# EAGLE design weblight (EAGLE 7.4.0)
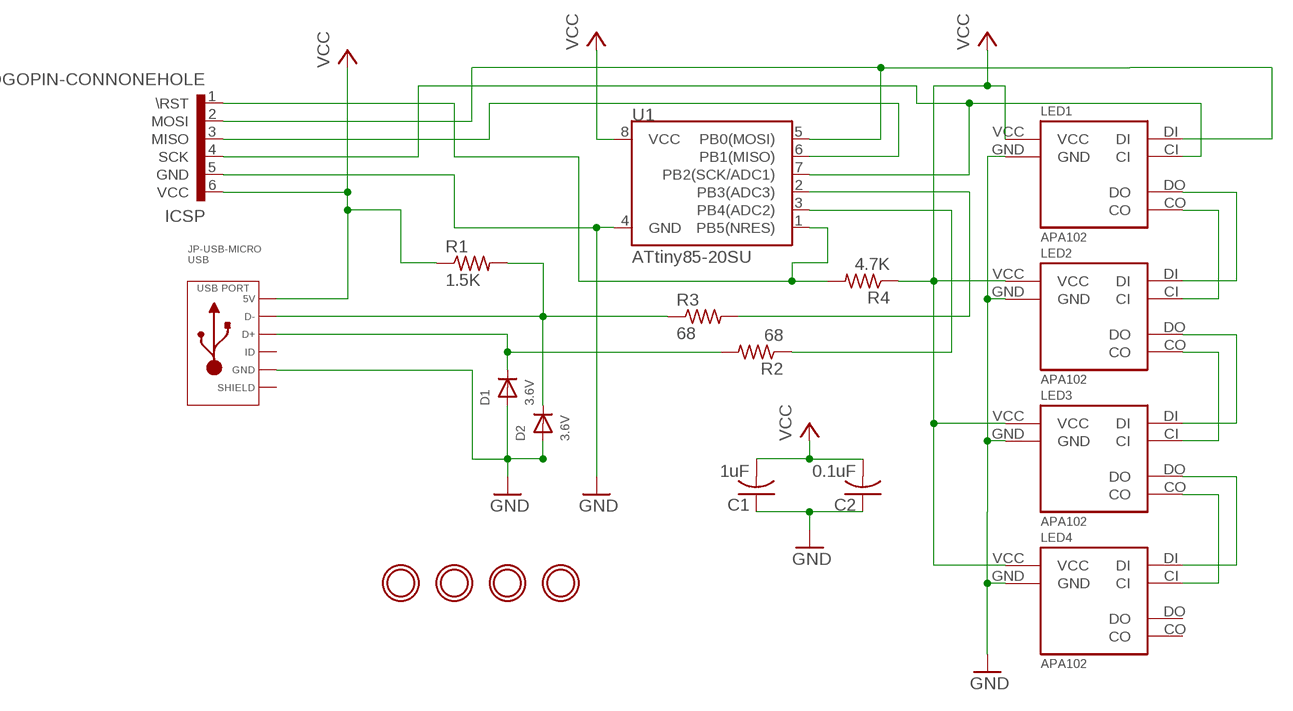
[diagram p0: schematic, sheet 1]

## Parts
C1  1uF  C-USC0402  [C0402]
C2  0.1uF  C-USC0402  [C0402]
D1  3.6V  DIODESOD-523  [SOD-523]
D2  3.6V  DIODESOD-523  [SOD-523]
HOLE1  MOUNTINGHOLE2.0  [MOUNTINGHOLE_2.0_PLATED]
HOLE2  MOUNTINGHOLE2.0  [MOUNTINGHOLE_2.0_PLATED]
HOLE3  MOUNTINGHOLE2.0  [MOUNTINGHOLE_2.0_PLATED]
HOLE4  MOUNTINGHOLE2.0  [MOUNTINGHOLE_2.0_PLATED]
ICSP  POGOPIN-CONNONEHOLE  [POGOPROG-CONN-1H]
JP-USB-MICRO  USB  USB_MICRO_RIGHT  [MICROUSB-RIGHT]
LED1  APA102  [APA102]
LED2  APA102  [APA102]
LED3  APA102  [APA102]
LED4  APA102  [APA102]
R1  1.5K  R-US_R0402  [R0402]
R2  68  R-US_R0402  [R0402]
R3  68  R-US_R0402  [R0402]
R4  4.7K  R-US_R0402  [R0402]
U1  ATtiny85-20SU  ATTINY45TINY85-20-SMT  [SO08-EIAJ]

## Nets
CLK_1/SCK: ICSP.4(SCK) LED1.CI U1.7(PB2(SCK/ADC1))
CLK_2: LED1.CO LED2.CI
CLK_3: LED2.CO LED3.CI
CLK_4: LED3.CO LED4.CI
DIN_1/MOSI: ICSP.2(MOSI) LED1.DI U1.5(PB0(MOSI))
DIN_2: LED1.DO LED2.DI
DIN_3: LED2.DO LED3.DI
DIN_4: LED3.DO LED4.DI
GND: C1.1 C2.1 D1.A D2.A ICSP.5(GND) JP-USB-MICRO.5(GND) LED1.GND LED2.GND LED3.GND LED4.GND U1.4(GND)
MISO: ICSP.3(MISO) U1.6(PB1(MISO))
N_RESET: ICSP.1(\RST) R4.2 U1.1(PB5(NRES))
USB_D_MINUS: R3.2 U1.2(PB3(ADC3))
USB_D_MINUS_RAW: D2.K(C) JP-USB-MICRO.2(D-) R1.2 R3.1
USB_D_PLUS: R2.1 U1.3(PB4(ADC2))
USB_D_PLUS_RAW: D1.K(C) JP-USB-MICRO.3(D+) R2.2
VCC: C1.2 C2.2 ICSP.6(VCC) JP-USB-MICRO.1(5V) LED1.VCC LED2.VCC LED3.VCC LED4.VCC R1.1 R4.1 U1.8(VCC)
Unconnected: JP-USB-MICRO.4(ID) LED4.CO LED4.DO

## Power pins joined to a net without a drawn wire
SLD: JP-USB-MICRO.S1(SLD) JP-USB-MICRO.S2(SLD) JP-USB-MICRO.S3(SLD) JP-USB-MICRO.S4(SLD) JP-USB-MICRO.S5(SLD) JP-USB-MICRO.S6(SLD)

## Library data of the parts
C1 C2 = rcl:C-US: CAPACITOR, American symbol
D1 D2 = microbuilder:DIODE: Diode SMA Model Volts Amps Type Vf Vr Digikey # Notes SSA34-E3 40V 3A Schottky 480mV @ 3A 200uA @ 40V SSA34-E3/61TGITR-ND CDBA120-G 20V 1A Schottky 500mV @ 1A 500uA @ 20V 641-1014-6-ND REEL MBRA210 10V 2A Schottky 350mV @ 2A 700uA @ 10V MBRA210LT3 SOD-123 Model Volts Amps Type Vf Vr Order # Notes BAT54T1G 30V 200mA Schottky 800mV @ 200mA 2uA @ 25V BAT54T1GOSTR-ND B0530W 30V 500mA Schottky 430mV @ 500mA 130uA @ 30V B0530W-FDICT-ND REEL MBR120 1A 20V Schottky 340mV @ 1A MBR120VLSFT1GOSCT-ND SOD-323 Model Volts Amps Type Vf Vr Order # Notes PMEG2005EJ 20V 500mA Schottky 355mV @ 500mA 568-4110-1-ND ZLLS410 10V 570mA Schottky 380mV @ 570mA ZLLS410CT-ND 1N4148WS 75V 150mA Silicon/Simple 1V 1N4148WSFSCT-ND REEL SOD-523 Model Volts Amps Type Vf Vr Order # Notes BAT54XV2 30V 200mA Schottky 0.8V @ 100mA BAT54XV2CT-ND TB751S 30V 30mA Schottky RB751S-40TE61CT-ND SOT23-R/W (R = Solder Paste/Reflow Ovens, W = Hand-Soldering) Model Volts Amps Type Vf Vr Order # Notes BAT54FILM 40V 300mA Schottky 497-7162-1-ND
HOLE1-HOLE4 = microbuilder:MOUNTINGHOLE: Mounting Hole For #2 screws (0.086"/2.18mm width, 0.094"/2.4mm hole) use 2.5mm
ICSP = Protofusion:POGOPIN-CONN: Protofusion custom pogo pin programming header
JP-USB-MICRO = MF_Connectors:USB: Library: MF_Connectors Description: 5 Pin USB Connectors. SLD is the shield connection. Usually tied to ground through a small ferrite bead.
LED1-LED4 = weblight:APA102
R1-R4 = rcl:R-US_: RESISTOR, American symbol
U1 = SparkFun-DigitalIC:ATTINY45: Atmel 8-pin 2/4/8kB flash uC; PROD_ID: IC-09092; VALUE: Tiny85-20-SMT

## Board
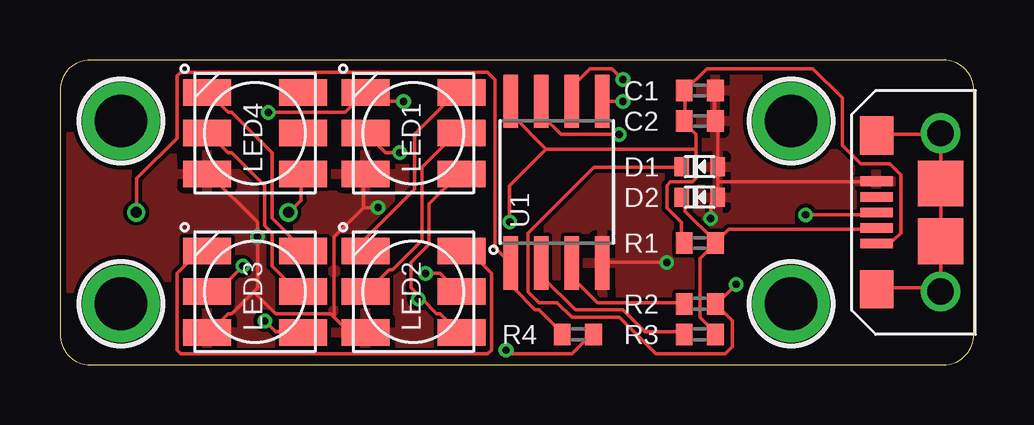
[diagram p1: board, top side]
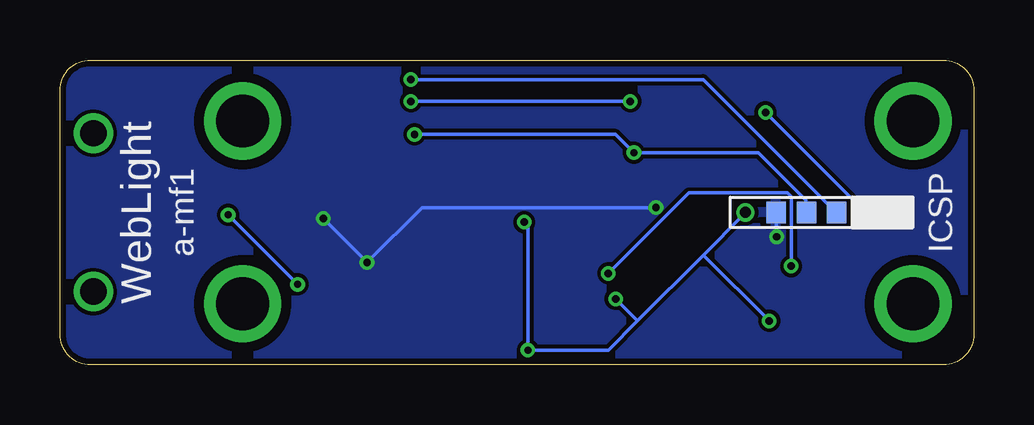
[diagram p2: board, bottom side, seen from below]

Size 38.1 x 12.7 mm. Coordinates in mm from the lower left corner, seen from the top.
Outline: 0,11.43 0,1.27 arc90 1.27,0 36.83,0 arc90 38.1,1.27 38.1,11.43 arc90 36.83,12.7 1.27,12.7 arc90 0,11.43
Copper layers (1*16): Top 0.035mm / dielectric 0.2mm / Bottom 0.035mm
Design rules "MacroFab_MF_2_Layer": minimum track width 6mil, minimum drill 12mil, track to track 6mil, track to pad 6mil, pad to pad 6mil, via to via 6mil, smd to smd 0mil, copper to edge 10mil, drill to drill 10mil, minimum pad ring 6mil, minimum via ring 6mil, stop-mask expansion 2mil, vias tented up to drill 25mil, thermal gap 10mil
vRestrict: area 33.7,0 to 36.2,12.7; area 32.4,0 to 33.7,12.7

### Footprints (pad centres in the part's own frame; a part is rotated, then mirrored left to right if it is on the bottom)
C0402 = smd 0.7 x 0.9: 1 -0.65,0; 2 0.65,0
SOD-523 = smd 0.8 x 0.6: A 0,-0.75; K 0,0.75
MOUNTINGHOLE_2.0_PLATED = drill 2.2 pad 3: P$1 0,0
POGOPROG-CONN-0H = drill 0.457: 1 0,3.81; 6 0,-2.54 | smd 0.889 x 0.813: 2 0,2.54; 3 0,1.27; 4 0,0; 5 0,-1.27
MICROUSB-RIGHT = smd 0.4 x 1.35: 1 -1.3,1.27; 2 -0.65,1.27; 3 0,1.27; 4 0.65,1.27; 5 1.3,1.27 | drill 1.1: S1 -3.3,-1.405; S2 3.3,-1.405 | smd 1.6 x 1.4: S3 -3.2,1.27; S4 3.2,1.27 | smd 1.9 x 1.9: S5 -1.2,-1.405; S6 1.2,-1.405
APA102 = smd 2 x 1.1: CI 2,0; CO -2,0; DI 2,-1.7; DO -2,-1.7; GND 2,1.7; VCC -2,1.7
R0402 = smd 0.7 x 0.9: 1 -0.65,0; 2 0.65,0
SO08-EIAJ = smd 0.61 x 2.21: 1 -1.905,-3.378; 2 -0.635,-3.378; 3 0.635,-3.378; 4 1.905,-3.378; 5 1.905,3.353; 6 0.635,3.353; 7 -0.635,3.353; 8 -1.905,3.353

### Placement (x,y rotation side)
C1  26.67,11.43 180 top
C2  26.67,10.16 180 top
D1  26.67,8.26 90 top
D2  26.67,6.99 90 top
HOLE1  2.54,10.16 0 top
HOLE2  30.48,10.16 0 top
HOLE3  30.48,2.54 0 top
HOLE4  2.54,2.54 0 top
ICSP  POGOPIN-CONNWITHVIAS  [POGOPROG-CONN-0H]  6.99,6.35 270 bottom
JP-USB-MICRO  35.31,6.35 90 top
LED1  14.73,9.65 180 top
LED2  14.73,3.05 180 top
LED3  8.13,3.05 180 top
LED4  8.13,9.65 180 top
R1  26.67,5.08 0 top
R2  26.67,2.54 0 top
R3  26.67,1.27 180 top
R4  21.59,1.27 180 top
U1  20.7,7.62 0 top

### Tracks (layer width: path | path; a pad name or v marks a point on that pad's centre or on a via)
CLK_1/SCK  (via drill 0.3)
  Top 0.152: v14.17,8.84 13.56,8.84 12.8,9.6 LED1.CI | v23.32,9.6 20.88,9.6 20.12,10.36 20.12,10.97 U1.7
  Bottom 0.152: ICSP.4 7.01,6.4 7.01,6.86 8.99,8.84 v14.17,8.84 14.94,9.6 v23.32,9.6
CLK_2
  Top 0.152: LED2.CI 12.8,3.05 13.72,3.96 13.87,3.96 15.09,5.18 15.09,8.23 16.61,9.75 LED1.CO
CLK_3  (via drill 0.3)
  Top 0.152: v7.62,4.12 6.55,3.05 6.25,3.05 LED3.CI | v15.24,3.81 15.85,3.81 16.61,3.05 LED2.CO
  Bottom 0.152: v7.62,4.12 7.62,7.01 7.77,7.16 11.89,7.16 v15.24,3.81
CLK_4
  Top 0.152: LED4.CI 6.25,9.6 7.01,8.84 7.16,8.84 8.53,7.47 8.53,5.79 8.84,5.49 8.84,4.12 9.91,3.05 10.06,3.05 LED3.CO
DIN_1/MOSI  (via drill 0.3)
  Top 0.152: v8.69,10.52 11.89,10.52 12.65,11.28 LED1.DI 12.8,11.28 13.11,10.97 v14.33,10.97 | v23.47,10.97 22.71,10.97 U1.5
  Bottom 0.152: v8.69,10.52 4.57,6.4 ICSP.2 | v14.33,10.97 v23.47,10.97
DIN_2
  Top 0.152: LED2.DI 12.8,4.88 12.8,5.33 14.78,7.32 14.78,9.6 16.61,11.43 LED1.DO
DIN_3
  Top 0.152: LED3.DI 6.1,4.72 5.79,4.72 4.88,3.81 4.88,0.61 5.03,0.46 17.83,0.46 17.98,0.61 17.98,3.81 17.07,4.72 16.76,4.72 LED2.DO
DIN_4
  Top 0.152: LED4.DI 6.25,11.28 7.01,10.52 7.16,10.52 8.84,8.84 8.84,6.1 10.06,4.88 LED3.DO
GND  (via drill 0.3)
  Top 0.152: LED4.GND 6.25,7.92 8.23,5.94 v8.23,5.33 8.23,3.2 8.08,3.05 | 8.08,3.05 7.16,2.13 7.01,2.13 6.25,1.37 LED3.GND | 11.43,1.98 11.28,2.13 8.99,2.13 8.08,3.05 | 11.43,1.98 12.04,1.37 12.65,1.37 LED2.GND | 12.65,6.55 12.65,7.92 LED1.GND | 12.65,6.55 11.43,5.33 11.43,1.98 | 27.43,7.62 27.43,8.23 D1.A 27.43,8.38 27.43,10.06 C2.1 27.28,10.21 27.28,11.43 C1.1 | 27.43,7.62 27.43,7.01 D2.A 27.28,6.86 27.13,6.71 v27.13,6.1 | 27.43,7.62 33.98,7.62 JP-USB-MICRO.5 | v25.3,4.27 22.71,4.27 U1.4 | v13.26,6.55 12.65,6.55
  Bottom 0.152: v8.23,5.33 8.23,6.25 ICSP.5 | v27.13,6.1 v25.3,4.27 23.01,6.55 v13.26,6.55
  pour Bottom: -1.27,13.97 39.37,13.97 39.37,-1.27 -1.27,-1.27
  pour Top: -0.64,13.34 38.73,13.34 38.73,-0.64 -0.64,-0.64
MISO  (via drill 0.3)
  Top 0.152: v23.47,11.89 23.01,12.34 22.1,12.34 21.34,11.58 U1.6
  Bottom 0.152: v23.47,11.89 11.28,11.89 5.79,6.4 ICSP.3
N_RESET
  Top 0.152: R4.2 20.88,1.37 19.96,2.29 19.81,2.29 18.9,3.2 18.9,4.12 U1.1 18.75,4.27 18.14,4.88 18.14,11.89 17.83,12.19 5.03,12.19 4.88,12.04 4.88,9.45 3.2,7.77 3.2,6.4 ICSP.1
SLD
  Top 0.152: JP-USB-MICRO.S3 34.14,3.2 36.58,3.2 JP-USB-MICRO.S1 36.73,3.2 36.73,5.03 JP-USB-MICRO.S5 36.73,5.18 36.73,7.47 JP-USB-MICRO.S6 36.73,7.62 36.73,9.6 JP-USB-MICRO.S2 36.58,9.6 34.14,9.6 JP-USB-MICRO.S4
USB_D_MINUS
  Top 0.152: R3.2 25.91,1.37 24.38,1.37 23.47,2.29 21.49,2.29 20.12,3.66 20.12,4.12 U1.2
USB_D_MINUS_RAW
  Top 0.152: D2.K 26.06,6.86 26.06,6.4 27.28,5.18 R1.2 | R3.1 27.28,1.37 26.67,1.98 26.67,4.42 27.28,5.03 R1.2 | JP-USB-MICRO.2 33.98,5.64 27.89,5.64 27.43,5.18 R1.2
USB_D_PLUS
  Top 0.152: R2.1 25.91,2.59 22.4,2.59 21.34,3.66 21.34,4.12 U1.3
USB_D_PLUS_RAW  (via drill 0.3)
  Top 0.152: D1.K 25.91,8.23 22.25,8.23 19.51,5.49 19.51,3.05 19.96,2.59 20.73,2.59 21.34,1.98 23.32,1.98 24.84,0.46 27.74,0.46 28.04,0.76 28.04,1.83 27.43,2.44 R2.2 27.43,2.59 v28.19,3.35 | v31.09,6.25 33.98,6.25 JP-USB-MICRO.3
  Bottom 0.152: v28.19,3.35 v31.09,6.25
VCC  (via drill 0.3)
  Top 0.152: 15.09,2.74 14.63,3.2 14.63,4.27 15.39,5.03 15.39,6.71 16.61,7.92 LED1.VCC | 15.09,2.74 15.7,2.13 15.85,2.13 16.61,1.37 LED2.VCC | v18.59,0.61 18.75,0.46 21.34,0.46 22.1,1.22 R4.1 | v8.53,1.83 8.99,1.37 10.06,1.37 LED3.VCC | LED4.VCC 10.06,7.92 10.06,6.86 9.6,6.4 ICSP.6 | v14.94,2.74 15.09,2.74 | 26.52,8.99 26.52,9.6 26.06,10.06 C2.2 26.06,10.21 26.06,11.43 | 26.52,8.99 26.52,7.77 26.36,7.62 25.45,7.62 25.3,7.47 25.3,6.55 25.91,5.94 25.91,5.18 R1.1 | 26.06,11.43 C1.2 26.06,11.43 | 26.06,11.43 26.98,12.34 31.39,12.34 32.61,11.12 32.61,9.14 33.38,8.38 34.59,8.38 35.05,7.92 35.05,5.49 34.75,5.18 34.14,5.18 JP-USB-MICRO.1 | 20.27,8.99 18.9,10.36 18.9,10.97 U1.8 | 26.52,8.99 20.27,8.99 | v18.75,5.94 18.75,7.47 20.27,8.99
  Bottom 0.152: 11.28,4.57 9.6,6.25 ICSP.6 | 11.28,4.57 14.02,1.83 | 14.02,1.83 15.24,0.61 v18.59,0.61 18.59,5.79 v18.75,5.94 | 11.28,4.57 v8.53,1.83 | 14.02,1.83 v14.94,2.74

### Text on the board
bPlace: a-mf1 | WebLight